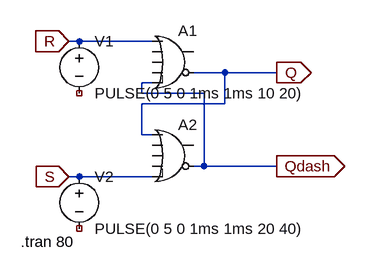
[diagram p0: schematic Draft1.asc]
* Draft1.asc
A1 R 0 0 0 Qdash Q 0 0 OR
A2 Q 0 0 0 S Qdash 0 0 OR
V1 R NC_01 PULSE(0 5 0 1ms 1ms 10 20)
V2 S NC_02 PULSE(0 5 0 1ms 1ms 20 40)
.tran 80
.backanno
.end

* Results of the author's LTspice run, read from the files saved beside the schematic
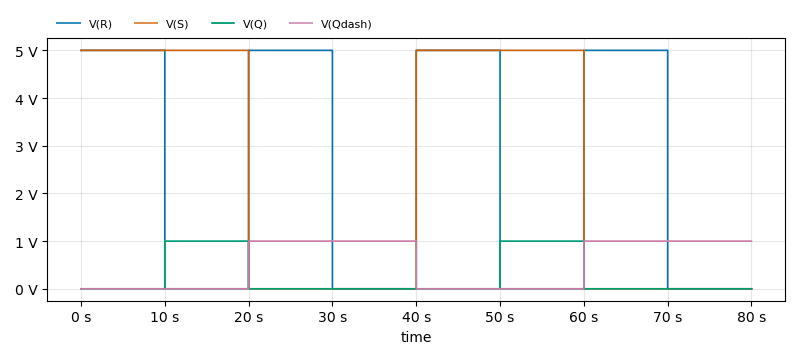
[diagram p1: Transient Analysis of Draft1.asc, plotted from the saved traces]
* Transient Analysis, 1 run:
*   V(R): min 0 V, max 5 V, average 2.5 V, rms 3.536 V, last 0 V
*   V(S): min 0 V, max 5 V, average 2.5 V, rms 3.536 V, last 0 V
*   V(Q): min 0 V, max 1 V, average 250 mV, rms 500 mV, last 0 V
*   V(Qdash): min 0 V, max 1 V, average 500 mV, rms 707.1 mV, last 1 V